# EAGLE design Clock Extension (EAGLE 7.6.0)
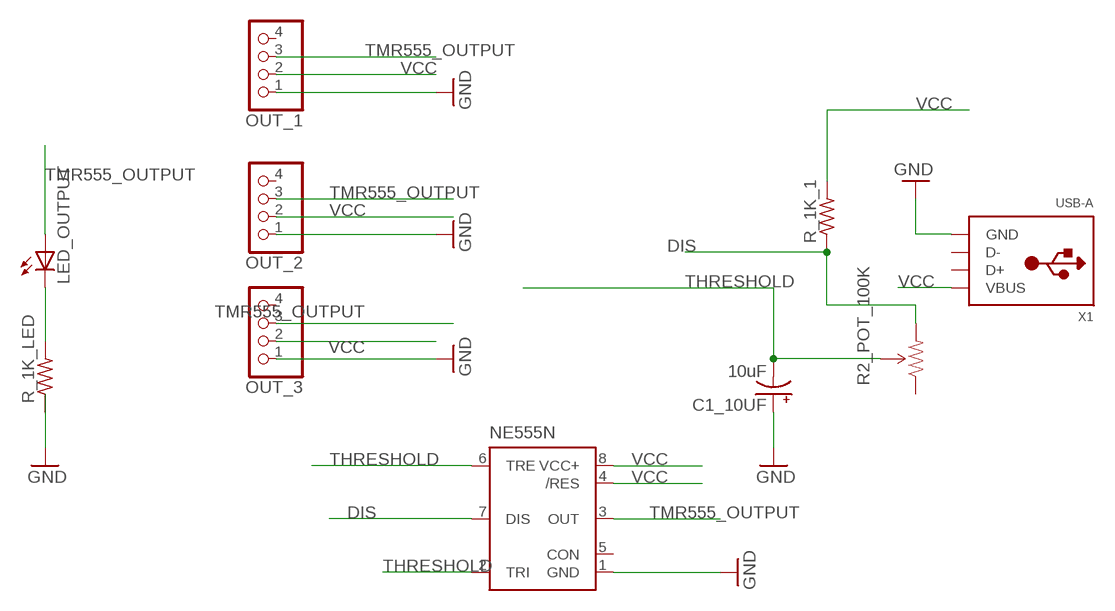
[diagram p0: schematic, sheet 1]

## Parts
C1_10UF  10uF  10UF-16V-10%(TANT)  [EIA3216]
LED_OUTPUT  LEDSMT1206  [1206]
NE555N  NE555D  [SO08]
OUT_1  PINHD-1X4  [1X04]
OUT_2  PINHD-1X4  [1X04]
OUT_3  PINHD-1X4  [1X04]
R2_POT_100K  TRIMPOTPTH  [TRIM_POT_PTH]
R_1K_1  R-US_R1206  [R1206]
R_1K_LED  R-US_R1206  [R1206]
X1  USB-A  [MOLEX_480371000]

## Nets
DIS: NE555N.7(DIS) R2_POT_100K.3(CW) R_1K_1.1
GND: C1_10UF.A(+) NE555N.1(GND) OUT_1.1 OUT_2.1 OUT_3.1 R_1K_LED.1 X1.4(GND)
N$5: LED_OUTPUT.C R_1K_LED.2
THRESHOLD: C1_10UF.C(-) NE555N.2(TRI) NE555N.6(TRE) R2_POT_100K.2(WIPER)
TMR555_OUTPUT: LED_OUTPUT.A NE555N.3(OUT) OUT_1.3 OUT_2.3 OUT_3.3
VCC: NE555N.4(/RES) NE555N.8(VCC+) OUT_1.2 OUT_2.2 OUT_3.2 R_1K_1.2 X1.1(VBUS)
Unconnected: NE555N.5(CON) OUT_1.4 OUT_2.4 OUT_3.4 R2_POT_100K.1(CCW) X1.2(D-) X1.3(D+)

## Library data of the parts
C1_10UF = SparkFun-Capacitors:10UF-16V-10%(TANT): CAP-00811 1206/EIA-3216 Tantalum capacitor; PROD_ID: CAP-00811
LED_OUTPUT = adafruit:LED: LED OSRAM: - CHIPLED LG R971, LG N971, LY N971, LG Q971, LY Q971, LO R971, LY R971 LH N974, LH R974 LS Q976, LO Q976, LY Q976 LO Q996 - Hyper CHIPLED LW Q18S LB Q993, LB Q99A, LB R99A - SideLED LS A670, LO A670, LY A670, LG A670, LP A670 LB A673, LV A673, LT A673, LW A673 LH A674 LY A675 LS A676, LA A676, LO A676, LY A676, LW A676 LS A679, LY A679, LG A679 - Hyper Micro SIDELED® LS Y876, LA Y876, LO Y876, LY Y876 LT Y87S - SmartLED LW L88C, LW L88S LB L89C, LB L89S, LG L890 LS L89K, LO L89K, LY L89K LS L896, LA L896, LO L896, LY L896 - TOPLED LS T670, LO T670, LY T670, LG T670, LP T670 LSG T670, LSP T670, LSY T670, LOP T670, LYG T670 LG T671, LOG T671, LSG T671 LB T673, LV T673, LT T673, LW T673 LH T674 LS T676, LA T676, LO T676, LY T676, LB T676, LH T676, LSB T676, LW T676 LB T67C, LV T67C, LT T67C, LS T67K, LO T67K, LY T67K, LW E67C LS E67B, LA E67B, LO E67B, LY E67B, LB E67C, LV E67C, LT E67C LW T67C LS T679, LY T679, LG T679 LS T770, LO T770, LY T770, LG T770, LP T770 LB T773, LV T773, LT T773, LW T773 LH T774 LS E675, LA E675, LY E675, LS T675 LS T776, LA T776, LO T776, LY T776, LB T776 LHGB T686 LT T68C, LB T68C - Hyper Mini TOPLED® LB M676 - Mini TOPLED Santana® LG M470 LS M47K, LO M47K, LY M47K Source: http://www.osram.convergy.de/
NE555N = SparkFun-AnalogIC:NE555: General purpose bipolar Timer
OUT_1-OUT_3 = pinhead:PINHD-1X4: PIN HEADER
R2_POT_100K = SparkFun-Electromechanical:TRIMPOT: Various small potentiometers for "set-and-forget" applications
R_1K_1 R_1K_LED = adafruit:R-US_: RESISTOR, American symbol
X1 = adafruit:USB-A: USB type A 'plug' Used for things that can directly connect to a USB port, say USB key

## Board
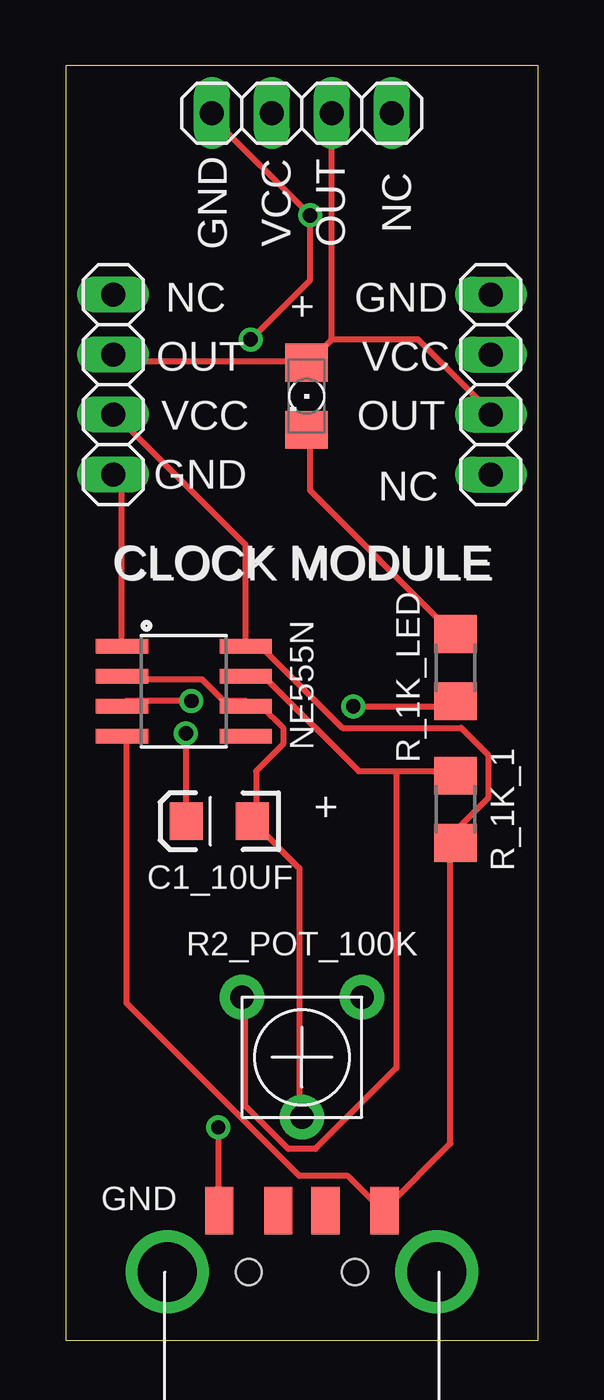
[diagram p1: board, top side]
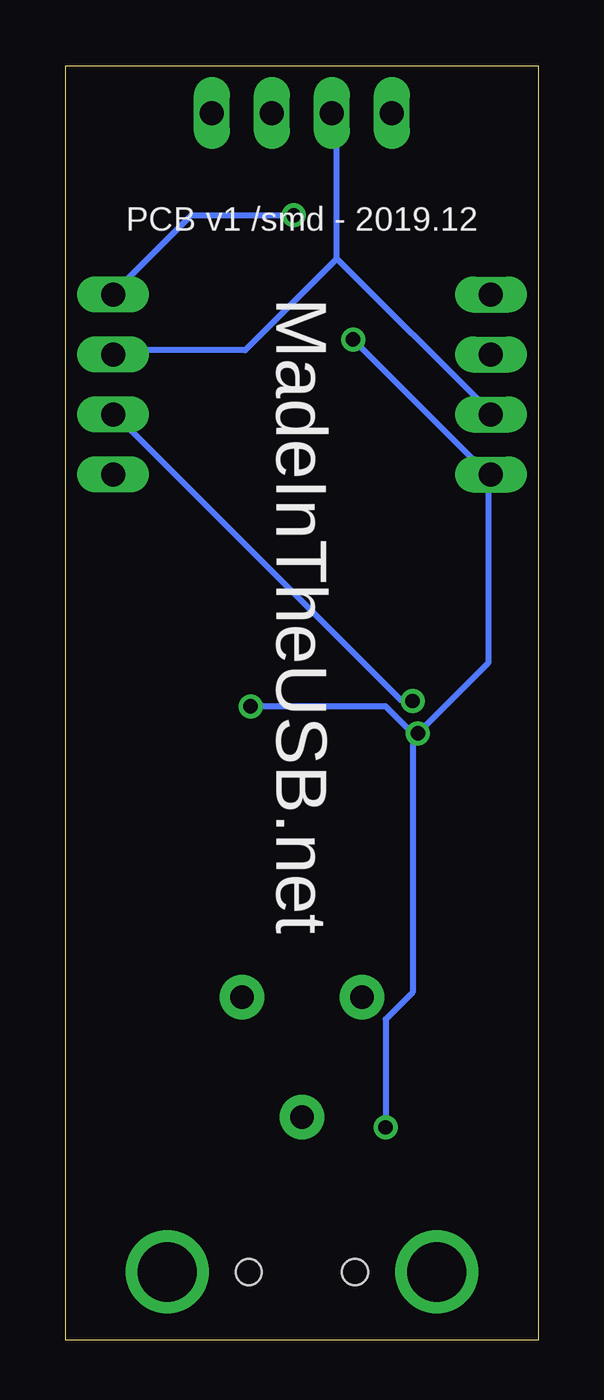
[diagram p2: board, bottom side, seen from below]

Size 20 x 54 mm. Coordinates in mm from the lower left corner, seen from the top.
Outline: 0,0 20,0 20,54 0,54 0,0
Copper layers (1*16): Top 0.035mm / dielectric 1.5mm / Bottom 0.035mm
Design rules "default": minimum track width 10mil, minimum drill 24mil, track to track 8mil, track to pad 8mil, pad to pad 8mil, via to via 8mil, smd to smd 8mil, copper to edge 40mil, drill to drill 8mil, minimum pad ring 10mil, minimum via ring 8mil, stop-mask expansion 4mil, vias tented up to drill 0mil, thermal gap 10mil

### Footprints (pad centres in the part's own frame; a part is rotated, then mirrored left to right if it is on the bottom)
EIA3216 = smd 1.4 x 1.6: A 1.4,0; C -1.4,0
1206 = smd 1.6 x 1.803: A -1.422,0; C 1.422,0
SO08 = smd 0.61 x 2.21: 1 -1.905,-2.616; 2 -0.635,-2.616; 3 0.635,-2.616; 4 1.905,-2.616; 5 1.905,2.616; 6 0.635,2.616; 7 -0.635,2.616; 8 -1.905,2.616
1X04 = drill 1.016 long: 1 -3.81,0; 2 -1.27,0; 3 1.27,0; 4 3.81,0
TRIM_POT_PTH = drill 1 pad 1.88: 1 -2.54,-2.54; 2 0,2.54; 3 2.54,-2.54
R1206 = smd 1.6 x 1.803: 1 -1.422,0; 2 1.422,0
MOLEX_480371000 = smd 1.2 x 2: 1 3.5,2.6; 2 1,2.6; 3 -1,2.6; 4 -3.5,2.6 | drill 2.5: M1 -5.7,0; M2 5.7,0 | hole 1.1: -2.25,0; 2.25,0

### Placement (x,y rotation side)
C1_10UF  6.5,22 180 top
LED_OUTPUT  10.2,40 270 top
NE555N  5,27.5 270 top
OUT_1  10,52 0 top
OUT_2  18,40.5 270 top
OUT_3  2,40.5 90 top
R2_POT_100K  10,12 180 top
R_1K_1  16.5,22.5 270 top
R_1K_LED  16.5,28.5 90 top
X1  10,2.9 0 top

### Tracks (layer width: path | path; a pad name or v marks a point on that pad's centre or on a via)
DIS
  Top 0.254: 14,24.12 12.4,24.12 8.52,28.01 7.83,28.01 NE555N.7 | 14,24.12 16.29,24.12 R_1K_1.1 | 14,24.12 14,11.55 10.57,8.12 9.43,8.12 7.6,9.95 7.6,14.52 R2_POT_100K.3
GND  (via drill 0.61)
  Top 0.254: OUT_1.1 6.23,51.78 v10.34,47.66 10.34,44.92 v7.83,42.41 | v5.09,25.72 5.09,22.06 C1_10UF.A | v12.17,26.86 16.29,26.86 R_1K_LED.1 | v6.46,9.03 6.46,5.6 X1.4 | NE555N.1 2.34,29.6 2.34,36.23 2.12,36.46 OUT_3.1
  Bottom 0.254: v10.34,47.66 14.69,47.66 17.89,44.46 OUT_2.1 | v12.17,26.86 6.46,26.86 5.32,25.72 | v6.46,9.03 6.46,13.6 5.32,14.75 5.32,25.72 | 5.32,25.72 v5.09,25.72 2.12,28.69 2.12,36.46 OUT_3.1 2.12,36.69 v7.83,42.41
N$5
  Top 0.254: LED_OUTPUT.C 10.34,38.52 10.34,36.01 16.29,30.06 R_1K_LED.2
THRESHOLD
  Top 0.254: NE555N.2 2.57,28.01 5.77,28.01 6.69,27.09 7.6,27.09 NE555N.6 7.83,26.86 8.29,26.86 9.2,25.95 9.2,25.26 8.06,24.12 8.06,22.06 C1_10UF.C 8.06,21.83 9.89,20 9.89,9.49 R2_POT_100K.2
TMR555_OUTPUT  (via drill 0.61)
  Top 0.254: OUT_3.3 2.12,41.72 2.34,41.49 10.12,41.49 LED_OUTPUT.A 10.34,41.49 11.26,42.41 | 11.26,42.41 11.26,51.78 OUT_1.3 | v5.32,27.09 2.57,27.09 NE555N.3 | 11.26,42.41 14.92,42.41 17.89,39.44 OUT_2.3
  Bottom 0.254: v5.32,27.09 5.77,27.09 17.89,39.21 OUT_2.3
VCC
  Top 0.254: NE555N.4 2.57,25.49 2.57,14.29 9.89,6.97 11.95,6.97 13.32,5.6 X1.1 13.54,5.6 16.29,8.34 16.29,20.92 R_1K_1.2 16.52,21.15 16.52,21.6 17.89,22.98 17.89,24.8 16.75,25.95 11.72,25.95 8.29,29.38 7.83,29.38 NE555N.8 7.6,29.6 7.6,33.72 2.12,39.21 OUT_3.2
  Bottom 0.254: 8.52,45.84 8.52,51.78 OUT_1.2 | 8.52,45.84 2.12,39.44 OUT_3.2 | 8.52,45.84 12.4,41.95 17.89,41.95 OUT_2.2

### Text on the board
tNames: GND | VCC | OUT | NC | NC | GND | + | OUT | VCC | VCC | OUT | GND | NC | CLOCK MODULE | CLOCK MODULE | + | GND
bNames: PCB v1 /smd - 2019.12 | MadeInTheUSB.net